# Altium schematic sheet DIY_BalanceCar_2022-06-02.schdoc
size 308 x 171 mm
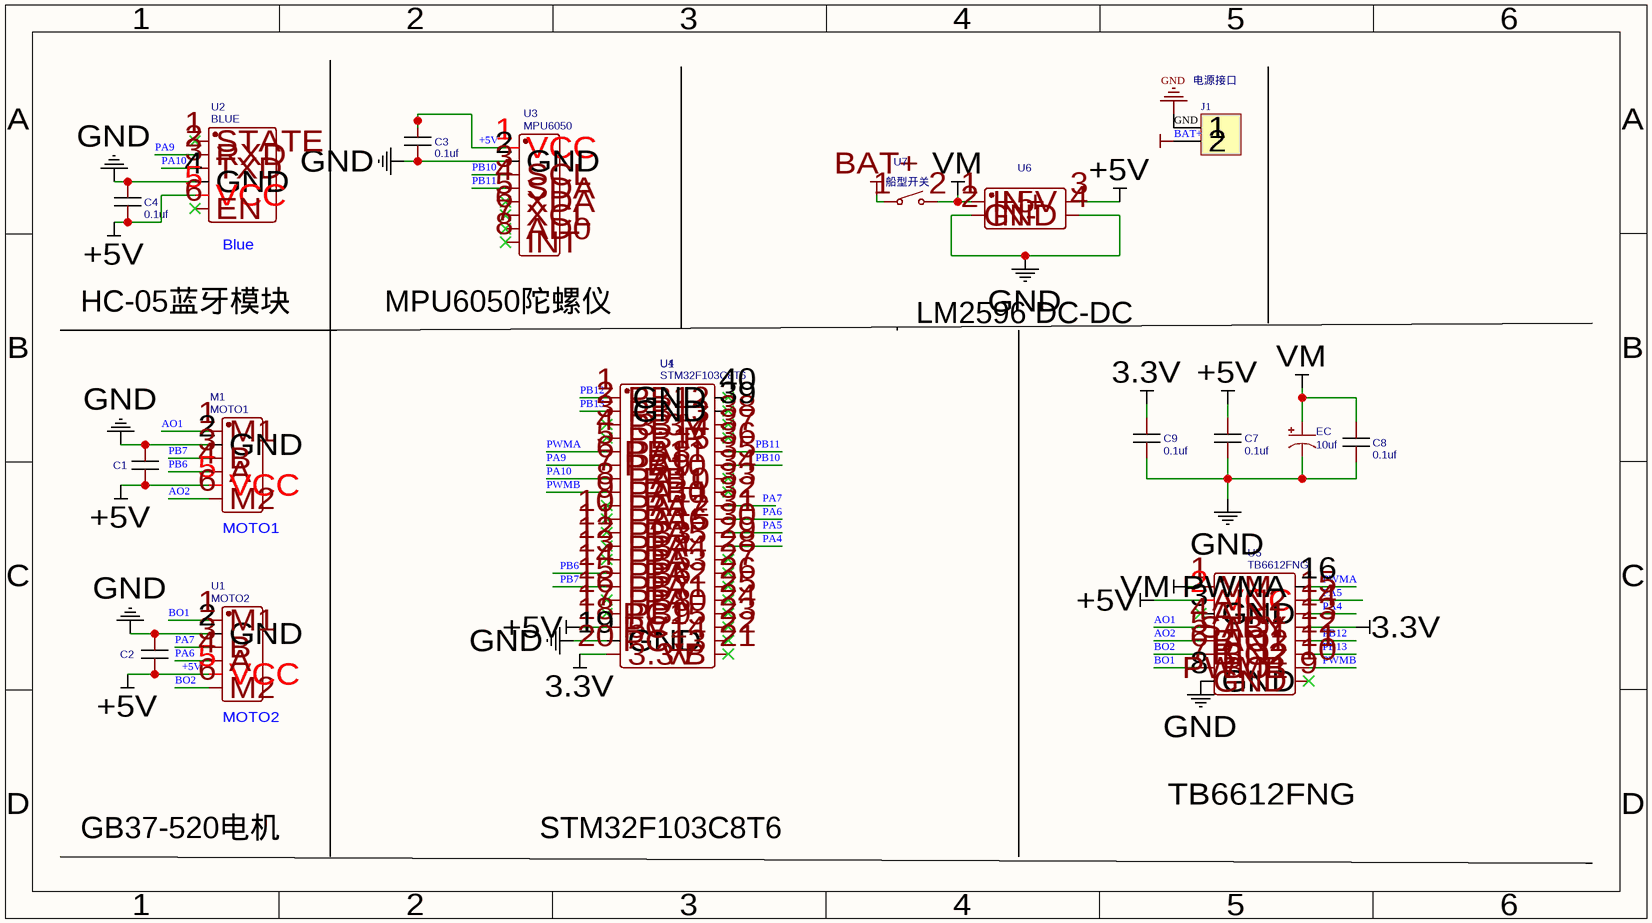
[diagram p0: DIY_BalanceCar_2022-06-02.schdoc]

## Parts
C1  0.1uf  [104低压瓷片电容（引脚4MM）]  (value not drawn)
C2  0.1uf  [104低压瓷片电容（引脚4MM）]  (value not drawn)
C3  0.1uf  [104低压瓷片电容（引脚4MM）]
C4  0.1uf  [104低压瓷片电容（引脚4MM）]
C7  0.1uf  [104低压瓷片电容（引脚4MM）]
C8  0.1uf  [104低压瓷片电容（引脚4MM）]
C9  0.1uf  [104低压瓷片电容（引脚4MM）]
C12  10uf  [10UF电解电容]  (value not drawn)
J  电源接口  [CONN-TH_2P-P5.00_WJ301V-5.00-2P]
M1  MOTO1  [CONN-TH_XH-6AW]
U1  MOTO2  [CONN-TH_XH-6AW]
U2  BLUE  [蓝牙]
U3  MPU6050  [MPU6050_____Ģ__]
U4  STM32F103C8T6  [STM32F103C8T6最小系统]
U5  TB6612FNG  [TB6612FNG]
U6  LM2596 DC-DC  [LM2596-MODULE]
U7  船型开关  [船型开关]

## Nets
3.3V: C9.1 U4.20(3.3V) U5.13(STBY)
+5V: C1.2 C2.2 C3.1 C4.2 C7.1 M1.5(VCC) U1.5(VCC) U2.5(VCC) U3.1(VCC) U4.18(5V) U5.2(VCC) U6.3(+5V)
BAT+: J.2 U7.1
GND: C1.1 C2.1 C3.2 C4.1 C7.2 C8.2 C9.2 C12.2 J.1 M1.2(GND) U1.2(GND) U2.4(GND) U3.2(GND) U4.19(GND) U5.8(GND) U6.2(IN-) U6.4(GND)
VM: C8.1 C12.1 U5.1(VM) U6.1(IN+) U7.2
AO1: M1.1(M1) U5.4(AO1)
AO2: M1.6(M2) U5.5(AO2)
BO1: U1.1(M1) U5.7(BO1)
BO2: U1.6(M2) U5.6(BO2)
PA4: U4.29(PA4) U5.14(AIN1)
PA5: U4.30(PA5) U5.15(AIN2)
PA6: U1.4(A) U4.31(PA6)
PA7: U1.3(B) U4.32(PA7)
PA9: U2.2(RXD) U4.6(PA9)
PA10: U2.3(TXD) U4.7(PA10)
PB6: M1.4(A) U4.14(PB6)
PB7: M1.3(B) U4.15(PB7)
PB10: U3.3(SCL) U4.35(PB10)
PB11: U3.4(SDA) U4.36(PB11)
PB12: U4.1(PB12) U5.12(BIN1)
PB13: U4.2(PB13) U5.11(BIN2)
PWMA: U4.5(PA8) U5.16(PWMA)
PWMB: U4.8(PA11) U5.10(PWMB)

Not connected (* = marked no-connect by the designer): U2 1(STATE)* 6(EN)*; U3 5(XDA)* 6(XCL)* 7(AD0)* 8(INT)*; U4 3(PB14)* 4(PB15)* 9(PA12)* 10(PA15)* 11(PB3)* 12(PB4)* 13(PB5)* 16(PB8)* 17(PB9)* 21(VB)* 22(PC13)* 23(PC14)* 24(PC15)* 25(PA0)* 26(PA1)* 27(PA2)* 28(PA3)* 33(PB0)* 34(PB1)* 37(R)* 38(3.3V)* 39(GND)* 40(GND)*; U5 3(GND)* 9(GND)*

## Notes on the sheet
- HC-05蓝牙模块
- (near U3) MPU6050陀螺仪
- GB37-520电机
- (in symbol 10uf) EC
- (in symbol BLUE) Blue
- (in symbol STM32F103C8T6) U1
- (in symbol 电源接口) GND; J1

## Library data of the parts
C1 C2 = 0.1uf: BOM_Manufacturer: ValuePro; BOM_Manufacturer Part: 0.1uF 50V 4*5 Black high frequency; Contributor: heiweilu; BOM_Supplier Part: C45093; BOM_Supplier: LCSC; spicePre: C; spiceSymbolName: MLCC5.08-A
C3 C4 C7-C9 = 0.1uf: Contributor: heiweilu; spicePre: C
  C3 C4 C8: spiceSymbolName: 0.1uf退耦电容
  C7 C9: spiceSymbolName: 0.1uf
C12 = 10uf: Contributor: heiweilu; spicePre: U; spiceSymbolName: 10uf
J = 电源接口: BOM_Manufacturer: ReliaPro; BOM_Manufacturer Part: WJ301V-5.0-2P; Contributor: heiweilu; BOM_Supplier Part: C8475; BOM_Supplier: LCSC; spicePre: U; spiceSymbolName: 电源接口
M1 = MOTO1: BOM_Manufacturer: BOOMELE; BOM_Manufacturer Part: XH-6AW; Contributor: heiweilu; BOM_Supplier Part: C8876; BOM_Supplier: LCSC; spicePre: M; spiceSymbolName: MOTO1
U1 = MOTO2: BOM_Manufacturer: BOOMELE; BOM_Manufacturer Part: XH-6AW; Contributor: heiweilu; BOM_Supplier Part: C8876; BOM_Supplier: LCSC; spicePre: U; spiceSymbolName: MOTO2
U2 = BLUE: Contributor: heiweilu; spicePre: U; spiceSymbolName: BLUE
U3 = MPU6050: Contributor: heiweilu; spicePre: U; spiceSymbolName: MPU6050
U4 = STM32F103C8T6: Contributor: heiweilu; spicePre: U; spiceSymbolName: STM32F103C8T6
U5 = TB6612FNG: Contributor: heiweilu; spicePre: U; spiceSymbolName: TB6612FNG
U6 = LM2596 DC-DC: Contributor: heiweilu; spicePre: U; spiceSymbolName: LM2596 DC-DC
U7 = 船型开关: Contributor: heiweilu; spicePre: U; spiceSymbolName: 船型开关